# Altium schematic sheet Sensors_Mic.SchDoc
size A; SheetNumber: 12
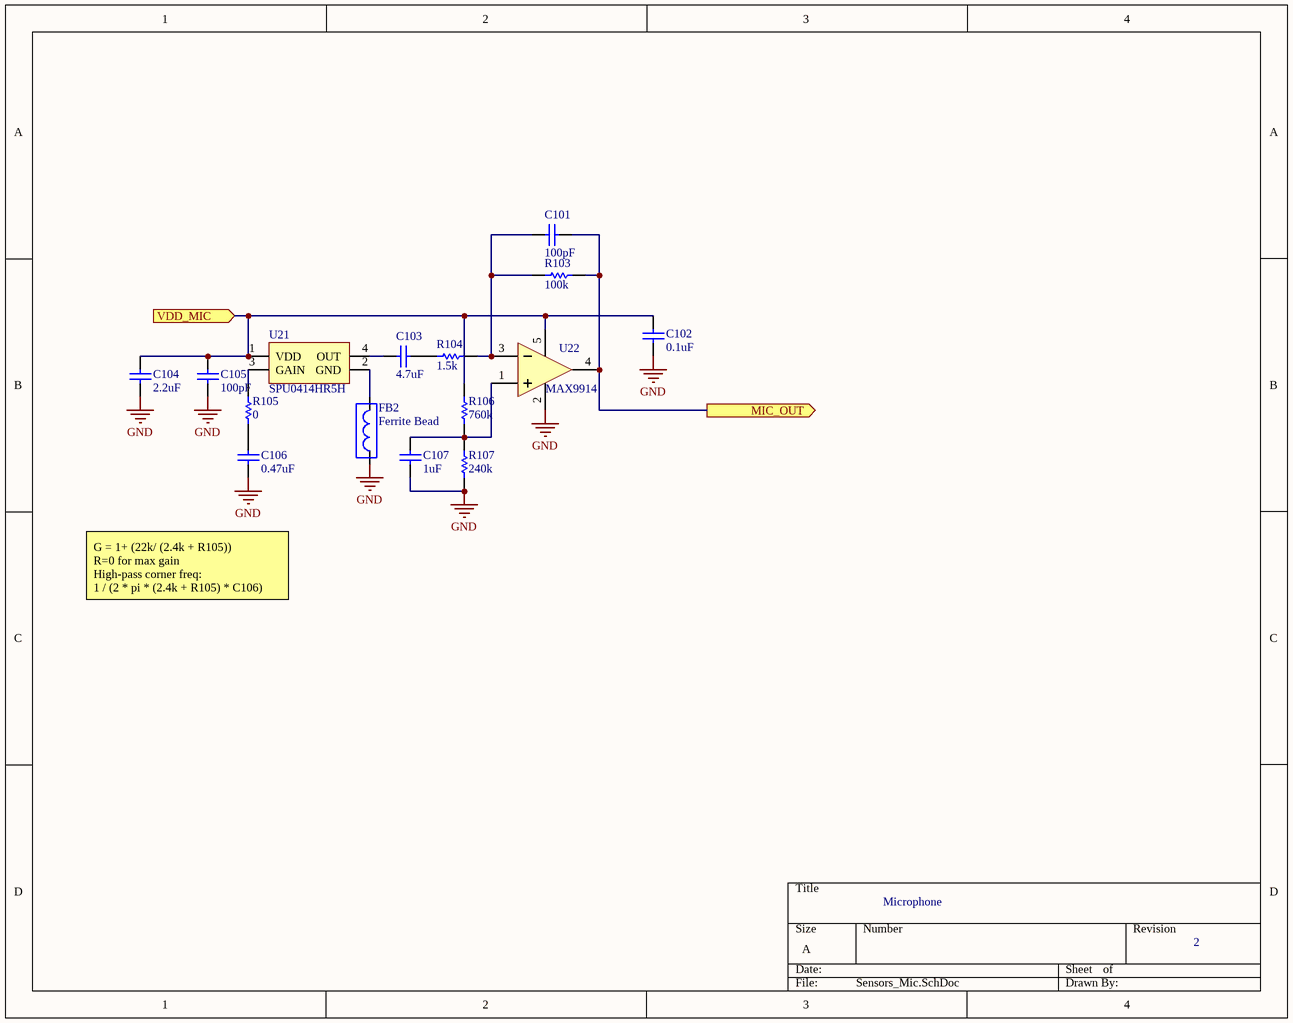
[diagram p0: Sensors_Mic.SchDoc]

## Parts
C101  value 100pF  [0603]  (hidden comment: Cap)
C102  value 0.1uF  [0603]  (hidden comment: Cap)
C103  value 4.7uF  [0603]  (hidden comment: Cap)
C104  value 2.2uF  [0603]  (hidden comment: Cap)
C105  value 100pF  [0603]  (hidden comment: Cap)
C106  value 0.47uF  [0603]  (hidden comment: Cap)
C107  value 1uF  [0603]  (hidden comment: Cap)
FB2  Ferrite Bead  [0603]
R103  value 100k  [0603]  (hidden comment: Res)
R104  value 1.5k  [0603]  (hidden comment: Res)
R105  value 0  [0603]  (hidden comment: Res)
R106  value 760k  [0603]  (hidden comment: Res)
R107  value 240k  [0603]  (hidden comment: Res)
U21  SPU0414HR5H  [SPU0414HR5H]
U22  MAX9914  [SC70-5]

## Ports
MIC_OUT (out), VDD_MIC (in)

## Nets
GND: C102.1 C104.1 C105.1 C106.1 C107.1 FB2.1 R107.1 U22.2(IN-)
MIC_OUT: C101.2 R103.2 U22.4(TAB) ; port MIC_OUT
VDD_MIC: C102.2 C104.2 C105.2 R106.2 U21.1(VDD) U22.5(OS_NUL) ; port VDD_MIC
NetC101_1: C101.1 R103.1 R104.2 U22.3(IN+)
NetC103_1: C103.1 U21.4(OUT)
NetC103_2: C103.2 R104.1
NetC106_2: C106.2 R105.1
NetC107_2: C107.2 R106.1 R107.2 U22.1(OS_NUL)
NetFB2_2: FB2.2 U21.2(GND)
NetR105_2: R105.2 U21.3(GAIN)

## Notes on the sheet
- G = 1+ (22k/ (2.4k + R105))
  R=0 for max gain
  High-pass corner freq:
  1 / (2 * pi * (2.4k + R105) * C106)
- Microphone
- 2

## Library data of the parts
C101 C105 = Cap: Ceramic Capacitor (Surface Mount); Manufacturer: Kemet; Manufacturer Part Number: C0603C101J5GACTU; Digi-Key Part Number: *; Note: *; Rating: *; Distributor Part Number: 399-1061-1-ND; Distributor: Digi-Key
C102 = Cap: Ceramic Capacitor (Surface Mount); Manufacturer: Murata Electronics North America; Manufacturer Part Number: GRM188R71C104KA01D; Digi-Key Part Number: *; Note: *; Rating: *; Distributor Part Number: 490-1532-1-ND; Distributor: Digi-Key
C103 = Cap: Ceramic Capacitor (Surface Mount); Manufacturer: Samsung Electro-Mechanics; Manufacturer Part Number: CL10B475KQ8NQNC; Digi-Key Part Number: *; Note: *; Rating: *; Distributor Part Number: 1276-2087-1-ND; Distributor: Digi-Key
C104 = Cap: Ceramic Capacitor (Surface Mount); Manufacturer: Murata Electronics North America; Manufacturer Part Number: GRM188R61C225KE15D; Digi-Key Part Number: *; Note: *; Rating: *; Distributor Part Number: 490-3296-1-ND; Distributor: Digi-Key
C106 = Cap: Ceramic Capacitor (Surface Mount); Manufacturer: TDK Corporation; Manufacturer Part Number: C1608X7R1C474K080AC; Digi-Key Part Number: *; Note: *; Rating: *; Distributor Part Number: 445-5192-1-ND; Distributor: Digi-Key
C107 = Cap: Ceramic Capacitor (Surface Mount); Manufacturer: Murata Electronics North America; Manufacturer Part Number: GRM188R61A105KA61D; Digi-Key Part Number: *; Note: *; Rating: *; Distributor Part Number: 490-1543-1-ND; Distributor: Digi-Key
FB2 = Ferrite Bead: Ferrite bead, RF choke; Manufacturer: Murata Electronics North America; Manufacturer Part Number: BLM18HE152SN1D; Digi-Key Part Number: 490-5216-1-ND; Rating: *; Note: *; Value: *; Distributor: Digikey; Distributor Part Number: 490-5216-1-ND
R103 = Res: Chip Resistor (Surface Mount); Manufacturer: Yageo; Manufacturer Part Number: RT0603FRE07100KL; Digi-Key Part Number: *; Rating: *; Note: *; Distributor: Digi-Key; Distributor Part Number: YAG2319CT-ND
R104 = Res: Chip Resistor (Surface Mount); Manufacturer: Vishay Dale; Manufacturer Part Number: CRCW06031K50JNEA; Digi-Key Part Number: *; Rating: *; Note: *; Distributor: Digi-Key; Distributor Part Number: 541-1.5KGCT-ND
R105 = Res: Chip Resistor (Surface Mount); Manufacturer: Yageo; Manufacturer Part Number: RC0603JR-070RL; Digi-Key Part Number: *; Rating: *; Note: *; Distributor: Digi-Key; Distributor Part Number: 311-0.0GRCT-ND
R106 = Res: Chip Resistor (Surface Mount); Manufacturer: Yageo; Manufacturer Part Number: RC0603FR-07750KL; Digi-Key Part Number: *; Rating: *; Note: *; Distributor: Digi-Key; Distributor Part Number: 311-750KHRCT-ND
R107 = Res: Chip Resistor (Surface Mount); Manufacturer: Yageo; Manufacturer Part Number: RC0603FR-07240KL; Digi-Key Part Number: *; Rating: *; Note: *; Distributor: Digi-Key; Distributor Part Number: 311-240KHRCT-ND
U21 = SPU0414HR5H: Knowles Analog Top MEMS Microphone; Manufacturer Part Number: SPU0414HR5H-SB; Digi-Key Part Number: 423-1134-1-ND; Distributor: Mouser; Distributor Part Number: 721-SPU0414HR5H-SB; Manufacturer: Knowles; Mouser Part Number: 721-SPU0414HR5H-SB
U22 = OPA333, 2333: Low power opamp; Manufacture: Maxim Integrated; Manufacture Part Number: MAX9914EXK+T; Digi-Key Part Number: MAX9914EXK+TCT-ND; Distributor: Mouser; Distributor Part Number: 700-MAX9914EXKT; Note: *; Rating: *; Value: *; Mouser Part Number: 700-MAX9914EXKT